# EAGLE schematic OLM-1.0 (EAGLE 6.2)
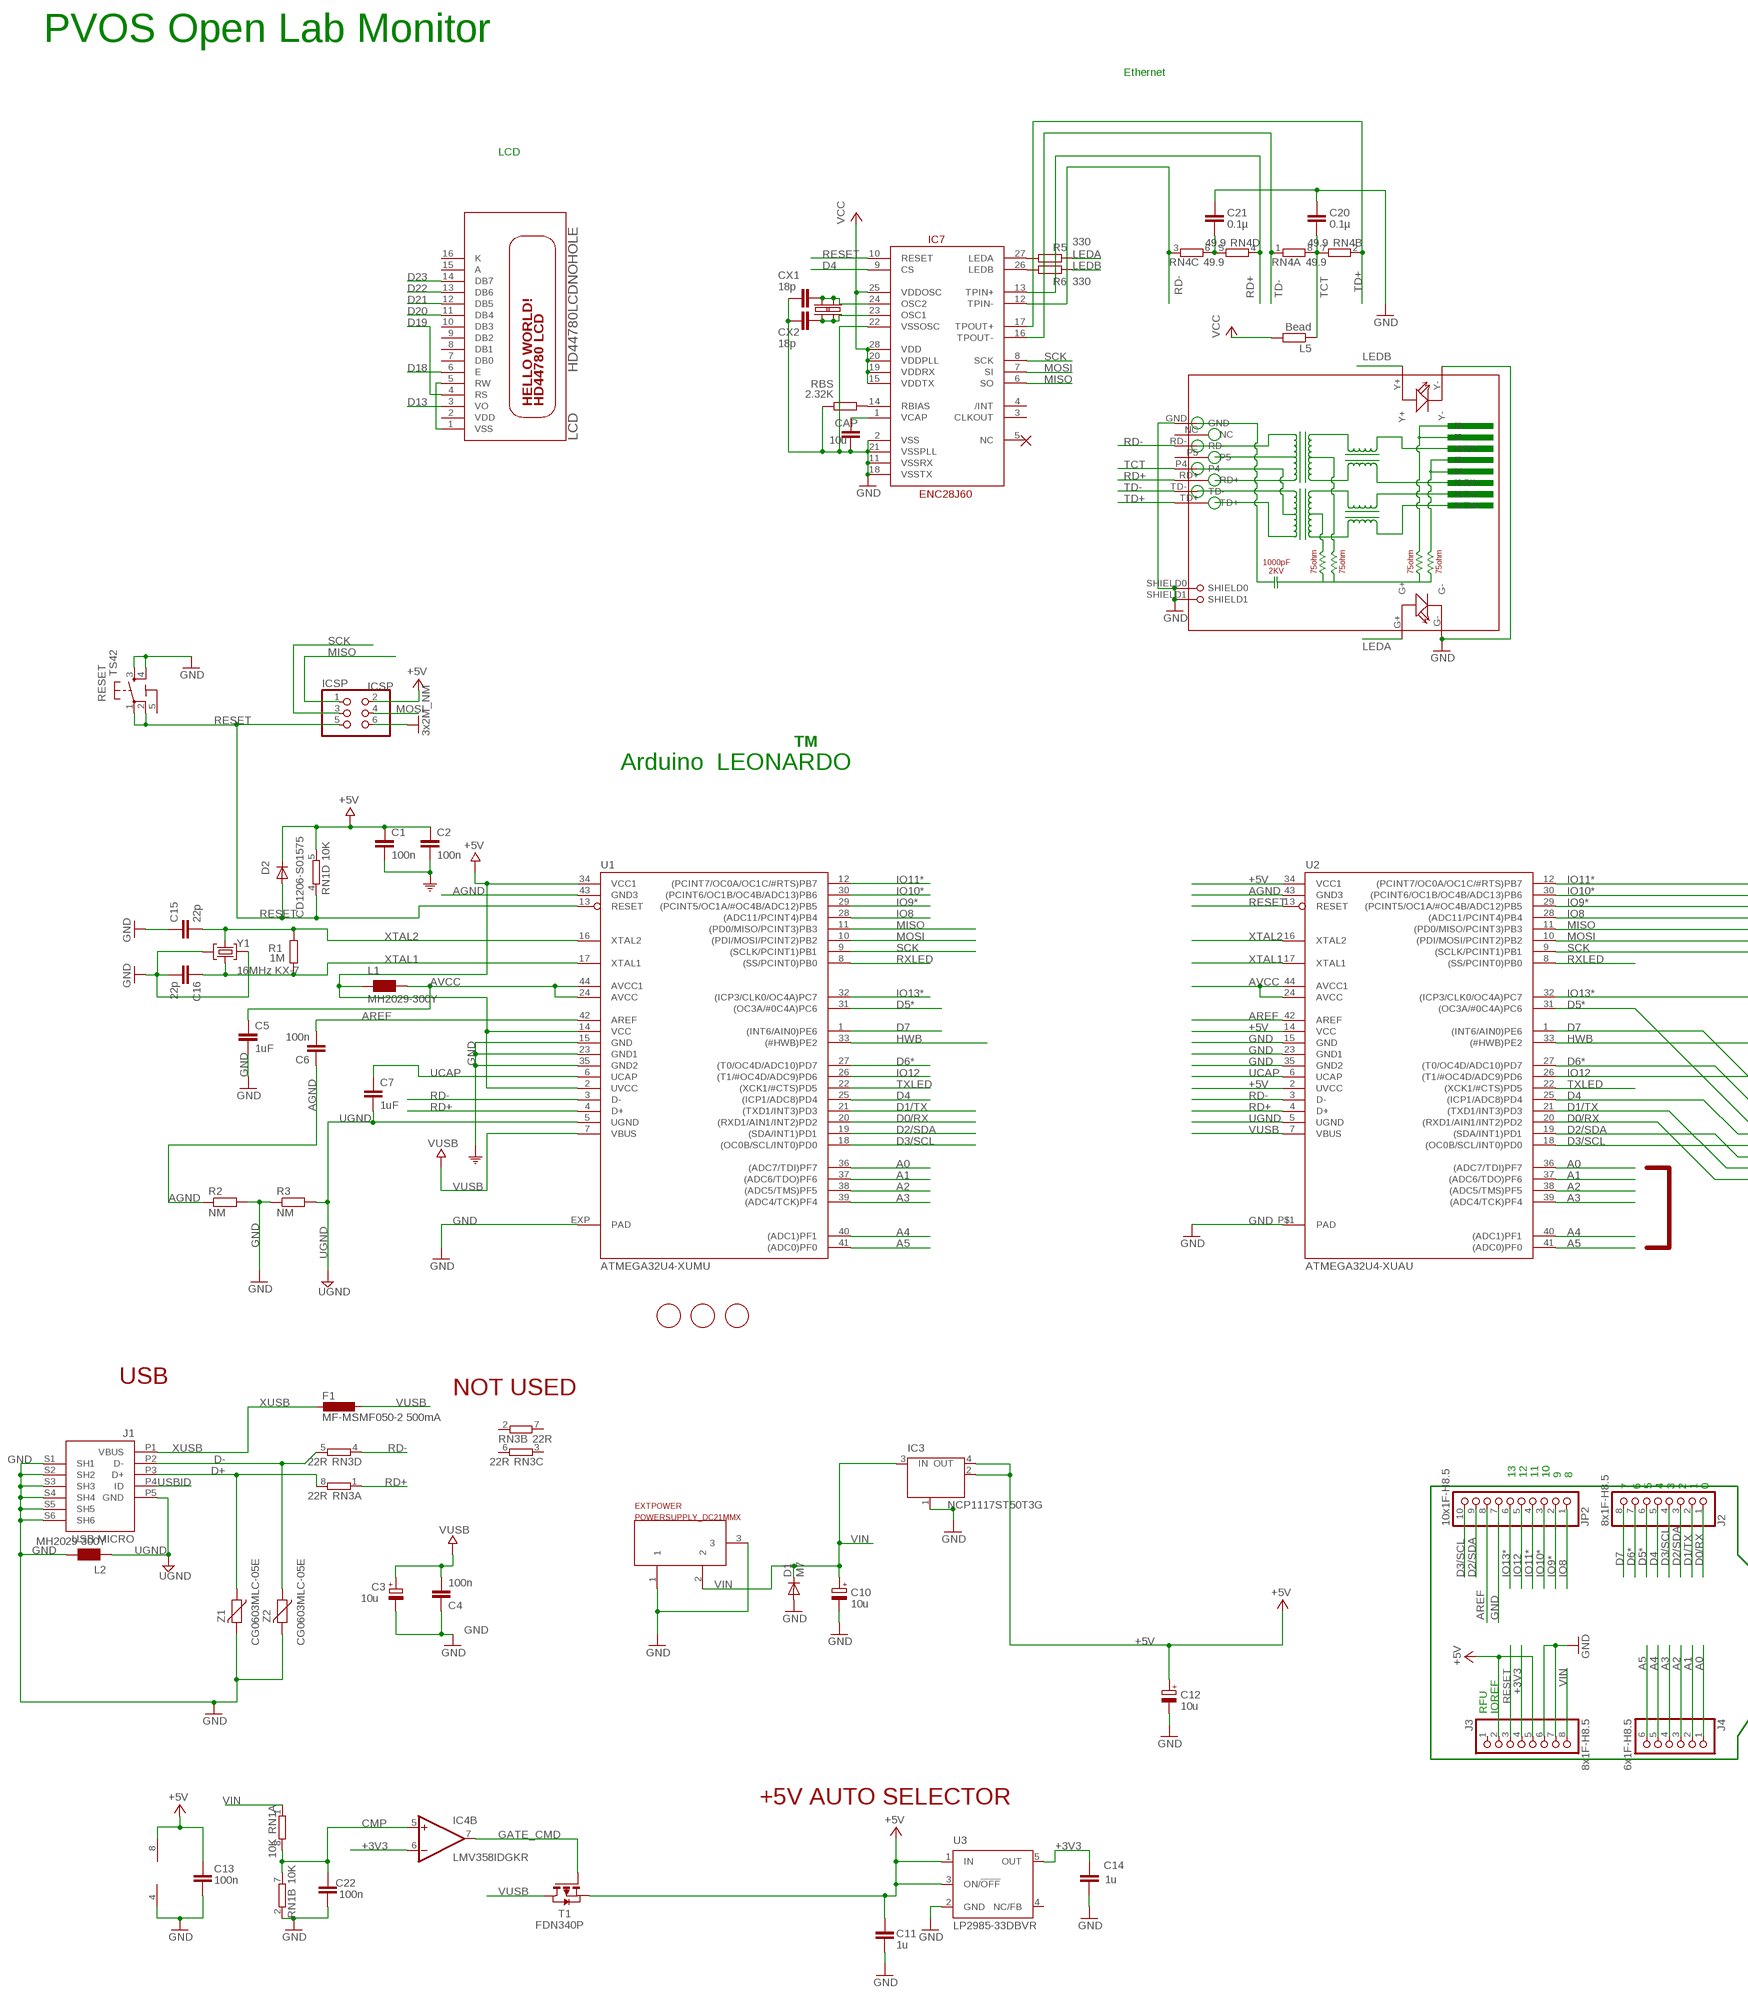
[diagram p0: schematic, sheet 1, part 1 of 2]
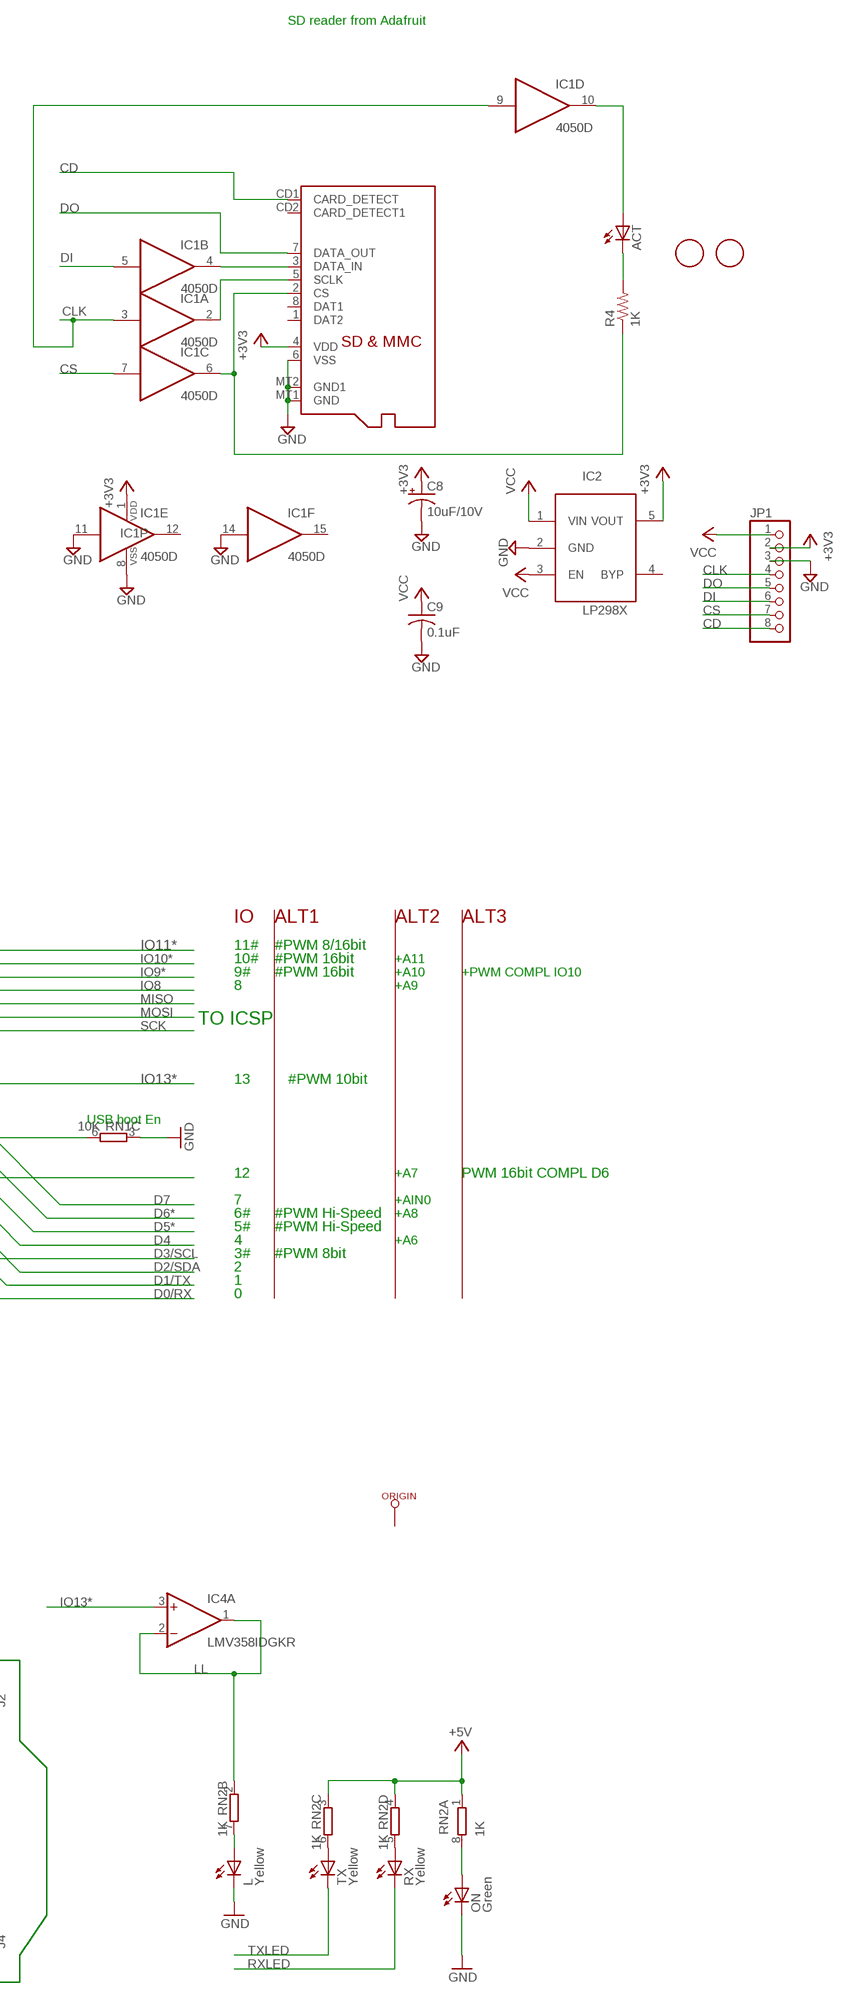
[diagram p1: schematic, sheet 1, part 2 of 2]

## Parts
ACT  LEDCHIP-LED0805  [CHIP-LED0805]
C1  100n  C-EUC0603  [C0603-ROUND]
C2  100n  C-EUC0603  [C0603-ROUND]
C3  10u  CPOL-EUSMCB  [SMC_B]
C4  100n  C-EUC0603  [C0603-ROUND]
C5  1uF  C-EUC0603  [C0603-ROUND]
C6  100n  C-EUC0603  [C0603-ROUND]
C7  1uF  C-EUC0603  [C0603-ROUND]
C8  10uF/10V  CPOL-USA/3216-18R  [A/3216-18R]
C9  0.1uF  C-USC0805K  [C0805K]
C10  10u  CPOL-EUSMCB  [SMC_B]
C11  1u  C-EUC0603  [C0603-ROUND]
C12  10u  CPOL-EUSMCB  [SMC_B]
C13  100n  C-EUC0603  [C0603-ROUND]
C14  1u  C-EUC0603  [C0603-ROUND]
C15  22p  C-EUC0603  [C0603-ROUND]
C16  22p  C-EUC0603  [C0603-ROUND]
C20  0.1µ  C-EUC0805  [C0805]
C21  0.1µ  C-EUC0805  [C0805]
C22  100n  C-EUC0603  [C0603-ROUND]
CAP  10u  C-EUC0805  [C0805]
CX1  18p  C-EUC0805  [C0805]
CX2  18p  C-EUC0805  [C0805]
D1  M7  DIODE-SMB  [SMB]
D2  CD1206-S01575  DIODE-MINIMELF  [MINIMELF]
EXTPOWER  POWERSUPPLY_DC21MMX  [POWERSUPPLY_DC-21MM]
F1  MF-MSMF050-2 500mA  L-EUL1812  [L1812]
FID1  FIDUCIALMOUNT  [FIDUCIA-MOUNT]
FID2  FIDUCIALMOUNT  [FIDUCIA-MOUNT]
FID3  FIDUCIALMOUNT  [FIDUCIA-MOUNT]
IC1  4050D  [SO16]
IC2  LP298XS  [SOT23-5L]
IC3  NCP1117ST50T3G  MC33269ST-3.3T3  [SOT223]
IC4  LMV358IDGKR  LMV358MMX  [MSOP08]
IC7  ENC28J60  ENC28J60SO28LONG  [SOIC28WLONG]
ICSP  ICSP  PINHD-2X3  [2X03]
J1  USB MICRO  MYCON2_USB-MINI-B  [CON2_USB_MICRO_B_AT]
J2  8x1F-H8.5  PINHD-1X8  [1X08]
J3  8x1F-H8.5  PINHD-1X8  [1X08]
J4  6x1F-H8.5  PINHD-1X6  [1X06]
JP1  PINHD-1X8BIG  [1X08-BIG]
JP2  10x1F-H8.5  PINHD-1X10  [1X10]
L  Yellow  LEDCHIPLED_0805  [CHIPLED_0805]
L1  MH2029-300Y  WE-CBF_0805  [0805]
L2  MH2029-300Y  WE-CBF_0805  [0805]
L5  Bead  R-EU_R0805  [R0805]
LCD  HD44780LCDNOHOLE  [LCD1602A]
ON  Green  LEDCHIPLED_0805  [CHIPLED_0805]
ORIGIN  TP_SP  [TP-SP]
R1  1M  R-EU_R0603  [R0603-ROUND]
R2  NM  R-EU_R0402  [R0402]
R3  NM  R-EU_R0402  [R0402]
R4  1K  R-US_R0805  [R0805]
R5  330  R-EU_R0805  [R0805]
R6  330  R-EU_R0805  [R0805]
RBS  2.32K  R-EU_R0805  [R0805]
RESET  TS42  [TS42]
RJ1  HR911105A  [HR911105A]
RN1  10K  4R-NCAY16  [CAY16]
RN2  1K  4R-NCAY16  [CAY16]
RN3  22R  4R-NCAY16  [CAY16]
RN4  49.9  4R-NEXB38V  [EXB38V]
RX  Yellow  LEDCHIPLED_0805  [CHIPLED_0805]
T1  FDN340P  PMOSSOT23  [SOT-23]
TX  Yellow  LEDCHIPLED_0805  [CHIPLED_0805]
U1  ATMEGA32U4-XUMU  [QFN44ML7X7]
U2  ATMEGA32U4-XUAU  [TQFP44-PAD]
U3  LP2985-33DBVR  LP2985-XXDBVR33  [SOT23-DBV]
U$1  FIDUCIAL  [FIDUCIAL_1MM]
U$2  FIDUCIAL  [FIDUCIAL_1MM]
X1  MICROSD  [MICROSD]
X2A  25MHz  CRYSTAL10.5X4.8  [CRYSTAL-SMD-10.5X4.8-2PIN]
X2A1  25MHz  CRYSTALHC49US  [HC49US]
Y1  16MHz KX-7  CRYSTAL-3.2-2.5  [CRYSTAL-3.2-2.5]
Z1  CG0603MLC-05E  VARISTORCN0603  [CT/CN0603]
Z2  CG0603MLC-05E  VARISTORCN0603  [CT/CN0603]

## Nets
+3V3: C8.+ C14.2 IC1.1(P:VDD) IC2.5(VOUT) IC4.6(B:-IN) J3.4 JP1.2 U3.5(OUT) X1.4(VDD)
+5V [usbvcc]: C1.1 C2.1 C11.2 C12.+ C13.1 D2.C IC3.2(OUT) IC3.4(OUT) IC4.8(P:V+) ICSP.2 J3.2 J3.5 L1.1 RN1.5 RN2.1 RN2.3 RN2.4 T1.2(S) U1.2(UVCC) U1.14(VCC) U1.34(VCC1) U2.2(UVCC) U2.14(VCC) U2.34(VCC1) U3.1(IN) U3.3(ON/!OFF)
A0: J4.1 U1.36((ADC7/TDI)PF7) U2.36((ADC7/TDI)PF7)
A1: J4.2 U1.37((ADC6/TDO)PF6) U2.37((ADC6/TDO)PF6)
A2: J4.3 U1.38((ADC5/TMS)PF5) U2.38((ADC5/TMS)PF5)
A3: J4.4 U1.39((ADC4/TCK)PF4) U2.39((ADC4/TCK)PF4)
A4: J4.5 U1.40((ADC1)PF1) U2.40((ADC1)PF1)
A5: J4.6 U1.41((ADC0)PF0) U2.41((ADC0)PF0)
AGND: C6.1 R2.1 U1.43(GND3) U2.43(GND3)
AREF [aref]: C6.2 JP2.8 U1.42(AREF) U2.42(AREF)
AVCC: C5.1 L1.2 U1.24(AVCC) U1.44(AVCC1) U2.24(AVCC) U2.44(AVCC1)
CD: JP1.8 X1.CD1(CARD_DETECT)
CLK: IC1.3(A:I) IC1.9(D:I) JP1.4
CMP: C22.2 IC4.5(B:+IN) RN1.7 RN1.8
CS: IC1.7(C:I) JP1.7
D0/RX: J2.1 U1.20((RXD1/AIN1/INT2)PD2) U2.20((RXD1/AIN1/INT2)PD2)
D1/TX: J2.2 U1.21((TXD1/INT3)PD3) U2.21((TXD1/INT3)PD3)
D2/SDA: J2.3 JP2.9 U1.19((SDA/INT1)PD1) U2.19((SDA/INT1)PD1)
D3/SCL: J2.4 JP2.10 U1.18((OC0B/SCL/INT0)PD0) U2.18((OC0B/SCL/INT0)PD0)
D4: IC7.9(CS) J2.5 U1.25((ICP1/ADC8)PD4) U2.25((ICP1/ADC8)PD4)
D5*: J2.6 U1.31((OC3A/#0C4A)PC6) U2.31((OC3A/#0C4A)PC6)
D6*: J2.7 U1.27((T0/OC4D/ADC10)PD7) U2.27((T0/OC4D/ADC10)PD7)
D7: J2.8 U1.1((INT6/AIN0)PE6) U2.1((INT6/AIN0)PE6)
D13: LCD.3(VO)
D18: LCD.6(E)
D19: LCD.4(RS)
D20: LCD.11(DB4)
D21: LCD.12(DB5)
D22: LCD.13(DB6)
D23: LCD.14(DB7)
D+: J1.P3(D+) RN3.8 Z1.1
D-: J1.P2(D-) RN3.5 Z2.1
DI: IC1.5(B:I) JP1.6
DO: JP1.5 X1.7(DATA_OUT)
GATE_CMD: IC4.7(B:OUT) T1.3(G)
GND [gnd]: C1.2 C2.2 C3.- C4.1 C5.2 C8.- C9.2 C10.- C11.1 C12.- C13.2 C14.1 C15.1 C16.2 C20.1 C21.1 C22.1 CAP.2 CX1.2 CX2.2 D1.A EXTPOWER.1 EXTPOWER.3 IC1.8(P:VSS) IC1.11(E:I) IC1.14(F:I) IC2.2(GND) IC3.1(GND/ADJ) IC4.4(P:V-) IC7.2(VSS) IC7.11(VSSRX) IC7.18(VSSTX) IC7.21(VSSPLL) IC7.22(VSSOSC) ICSP.6 J1.S1(SH1) J1.S2(SH2) J1.S3(SH3) J1.S4(SH4) J1.S5(SH5) J1.S6(SH6) J3.6 J3.7 JP1.3 JP2.7 L2.2 L.C ON.C R2.2 R3.1 RBS.1 RESET.3 RESET.4 RJ1.G- RJ1.GND RJ1.SHIELD0 RJ1.SHIELD1 RJ1.Y- RN1.2 RN1.3 U1.15(GND) U1.23(GND1) U1.35(GND2) U1.EXP(PAD) U2.15(GND) U2.23(GND1) U2.35(GND2) U2.P$1(PAD) U3.2(GND) X1.6(VSS) X1.MT1(GND) X1.MT2(GND1) Y1.2(GND) Y1.4(GND) Z1.2 Z2.2 ; supply symbol labelled 3x2M_NM, COM
HWB: RN1.6 U1.33((#HWB)PE2) U2.33((#HWB)PE2)
IO8: JP2.1 U1.28((ADC11/PCINT4)PB4) U2.28((ADC11/PCINT4)PB4)
IO9*: JP2.2 U1.29((PCINT5/OC1A/#OC4B/ADC12)PB5) U2.29((PCINT5/OC1A/#OC4B/ADC12)PB5)
IO10*: JP2.3 U1.30((PCINT6/OC1B/OC4B/ADC13)PB6) U2.30((PCINT6/OC1B/OC4B/ADC13)PB6)
IO11*: JP2.4 U1.12((PCINT7/OC0A/OC1C/#RTS)PB7) U2.12((PCINT7/OC0A/OC1C/#RTS)PB7)
IO12: JP2.5 U1.26((T1/#OC4D/ADC9)PD6) U2.26((T1/#OC4D/ADC9)PD6)
IO13*: IC4.3(A:+IN) JP2.6 U1.32((ICP3/CLK0/OC4A)PC7) U2.32((ICP3/CLK0/OC4A)PC7)
LEDA: R5.2 RJ1.G+
LEDB: R6.2 RJ1.Y+
LL: IC4.1(A:OUT) IC4.2(A:-IN) RN2.2
MISO: IC7.6(SO) ICSP.1 U1.11((PD0/MISO/PCINT3)PB3) U2.11((PD0/MISO/PCINT3)PB3)
MOSI: IC7.7(SI) ICSP.4 U1.10((PDI/MOSI/PCINT2)PB2) U2.10((PDI/MOSI/PCINT2)PB2)
N$1: ACT.A IC1.10(D:O)
N$2: IC1.2(A:O) X1.5(SCLK)
N$3: IC1.6(C:O) R4.1 X1.2(CS)
N$4: ACT.C R4.2
N$5: IC1.4(B:O) X1.3(DATA_IN)
N$6: ON.A RN2.8
N$7: L.A RN2.7
N$9: RN2.6 TX.A
N$10: RN2.5 RX.A
N$34: IC7.27(LEDA) R5.1
N$37: IC7.26(LEDB) R6.1
N$39: CAP.1 IC7.1(VCAP)
N$41: CX1.1 IC7.24(OSC2) X2A1.2 X2A.P$2
N$42: CX2.1 IC7.23(OSC1) X2A1.1 X2A.P$1
N$54: C21.2 RN4.5 RN4.6
N$59: IC7.14(RBIAS) RBS.2
RD+: IC7.13(TPIN+) RJ1.RD+ RN3.1 RN4.4 U1.4(D+) U2.4(D+)
RD-: IC7.12(TPIN-) RJ1.RD- RN3.4 RN4.3 U1.3(D-) U2.3(D-)
RESET: D2.A IC7.10(RESET) ICSP.5 J3.3 RESET.1 RESET.2 RN1.4 U1.13(RESET) U2.13(RESET)
RXLED: RX.C U1.8((SS/PCINT0)PB0) U2.8((SS/PCINT0)PB0)
SCK: IC7.8(SCK) ICSP.3 U1.9((SCLK/PCINT1)PB1) U2.9((SCLK/PCINT1)PB1)
TCT: C20.2 L5.1 RJ1.P4 RN4.7 RN4.8
TD+: IC7.17(TPOUT+) RJ1.TD+ RN4.2
TD-: IC7.16(TPOUT-) RJ1.TD- RN4.1
TXLED: TX.C U1.22((XCK1/#CTS)PD5) U2.22((XCK1/#CTS)PD5)
UCAP: C7.1 U1.6(UCAP) U2.6(UCAP)
UGND [gnd]: C7.2 J1.P5(GND) L2.1 R3.2 U1.5(UGND) U2.5(UGND)
USBID: J1.P4(ID)
VCC: C9.1 IC2.1(VIN) IC2.3(EN) IC7.15(VDDTX) IC7.19(VDDRX) IC7.20(VDDPLL) IC7.25(VDDOSC) IC7.28(VDD) JP1.1 L5.2
VIN [power]: C10.+ D1.C EXTPOWER.2 IC3.3(IN) J3.8 RN1.1
VSS [gnd]: LCD.1(VSS) LCD.5(RW)
VUSB: C3.+ C4.2 F1.1 T1.1(D) U1.7(VBUS) U2.7(VBUS)
XTAL1: C16.1 R1.1 U1.17(XTAL1) U2.17(XTAL1) Y1.1(C1)
XTAL2: C15.2 R1.2 U1.16(XTAL2) U2.16(XTAL2) Y1.3(C2)
XUSB [usbvcc]: F1.2 J1.P1(VBUS)
Unconnected: IC1.12(E:O) IC1.15(F:O) IC2.4(BYP) IC7.3(CLKOUT) IC7.4(/INT) IC7.5(NC) J3.1 LCD.2(VDD) LCD.7(DB0) LCD.8(DB1) LCD.9(DB2) LCD.10(DB3) LCD.15(A) LCD.16(K) ORIGIN.X(TESTP) RJ1.NC RJ1.P5 RN3.2 RN3.3 RN3.6 RN3.7 U3.4(NC/FB) X1.1(DAT2) X1.8(DAT1) X1.CD2(CARD_DETECT1)

## Notes on the sheet
- PVOS Open Lab Monitor
- Ethernet
- SD reader from Adafruit
- LCD
- TM
- Arduino  LEONARDO
- IO | ALT1 | ALT2 | ALT3
- 11# | #PWM 8/16bit
- 10# | #PWM 16bit | +A11
- 9# | #PWM 16bit | +A10 | +PWM COMPL IO10
- 8 | +A9
- TO ICSP
- 13 | #PWM 10bit
- USB boot En
- 12 | +A7 | PWM 16bit COMPL D6
- 7 | +AIN0
- 6# | #PWM Hi-Speed | +A8
- 5# | #PWM Hi-Speed
- 4 | +A6
- 3# | #PWM 8bit
- 2
- 1
- 0
- USB
- NOT USED
- 13 | 12 | 11 | 10 | 9 | 8
- 7 | 6 | 5 | 4 | 3 | 2 | 1 | 0
- RFU | IOREF
- +5V AUTO SELECTOR

## Power pins joined to a net without a drawn wire
5-GND: RESET.5(5-GND)

## Library data of the parts
ACT = adafruit:LED: LED
C1 C2 C4-C7 C11 C13-C16 C22 = SmartPrj:C-EU: CAPACITOR, European symbol
C3 C10 C12 = rcl:CPOL-EU: POLARIZED CAPACITOR, European symbol
C8 = adafruit:CPOL-US: POLARIZED CAPACITOR, American symbol
C9 = adafruit:C-US: CAPACITOR, American symbol
C20 C21 CAP CX1 CX2 = resistor:C-EU: CAPACITOR, European symbol
D1 D2 = diode:DIODE-: DIODE
EXTPOWER = SmartPrj:POWERSUPPLY_DC21MM
F1 = rcl:L-EU: INDUCTOR, European symbol
FID1-FID3 = SmartPrj:FIDUCIALMOUNT
IC1 = 40xx:4050: Hex non-inverting BUFFER
IC2 = adafruit:LP298X
IC3 = linear:MC33269ST*: Adjustable Output Low Dropout Voltage Regulator 800 mA Source: http://www.onsemi.com/pub/Collateral/MC33269-D.PDF
IC4 = linear:LMV358?*: Dual General Purpose, Low Voltage, Rail-to-Rail Output Operational Amplifiers Source: http://www.national.com/mpf/LM/LMV321.html http://www.national.com/dt/lmv_qual.pdf
IC7 = SparkFun:ENC28J60
ICSP = SmartPrj:PINHD-2X3: PIN HEADER
J1 = SmartPrj:MYCON2_USB-MINI-B
J2 J3 = SmartPrj:PINHD-1X8: PIN HEADER
J4 = SmartPrj:PINHD-1X6: PIN HEADER
JP1 = adafruit:PINHD-1X8: PIN HEADER
JP2 = SmartPrj:PINHD-1X10: PIN HEADER
L ON RX TX = led:LED: LED
L1 L2 = wuerth-elektronik:WE-CBF: SMD EMI Suppression Ferrite Beads - excellent anti-EMI properties - low DCR - impedances till 3000 ohms - rated current up to 6 A
L5 R5 R6 RBS = rcl:R-EU_: RESISTOR, European symbol
LCD = adafruit:HD44780LCD: HD44780 LCD Standard character type LCDs, available in sizes from 8x1 to 40x4!
ORIGIN = SmartPrj:TP_SP
R1-R3 = SmartPrj:R-EU_: RESISTOR, European symbol
R4 = adafruit:R-US_: RESISTOR, American symbol
RESET = SmartPrj:TS42: TS42 Dongnan Electronics Tact switch VDC 12V - 50mA
RJ1 = CONNECTER:HR911105A
RN1-RN4 = resistor-dil:4R-N: Array Chip Resistor Source: RS Component / Phycomp; OC_FARNELL: unknown; OC_NEWARK: unknown
T1 = zetex:PMOSSOT23: MOS FET
U1 U2 = SmartPrj:ATMEGA32U4-XU
U3 = SmartPrj:LP2985-XXDBVR: ULTRALOW-POWER 50-mA LOW-DROPOUT LINEAR REGULATORS 50-mA Low-Dropout Regulator Source: http://focus.ti.com/lit/ds/symlink/tps77001.pdf
U$1 U$2 = adafruit:FIDUCIAL: For use by pick and place machines to calibrate the vision/machine, 1mm By microbuilder.eu
X1 = adafruit:MICROSD: Micro-SD / Transflash card holder with SPI pinout For the 3M # 2908-05WB-MG and/or 4UCON #19656 push-push type
X2A X2A1 = SparkFun:CRYSTAL: Crystals Various standard crystals. Proven footprints. Spark Fun Electronics SKU : COM-00534
Y1 = SmartPrj:CRYSTAL-3.2-2.5
Z1 Z2 = varistor:VARISTOR: VARISTOR

## Net classes
0 default: width 0.305 mm, clearance 0.203 mm
1 power: width 0.813 mm, clearance 0.203 mm
2 gnd: width 0.254 mm, drill 0.61 mm, clearance 0.254 mm
3 usbvcc: width 0.254 mm, drill 0.61 mm, clearance 0.254 mm
4 aref: width 0.254 mm, drill 0.61 mm, clearance 0.254 mm